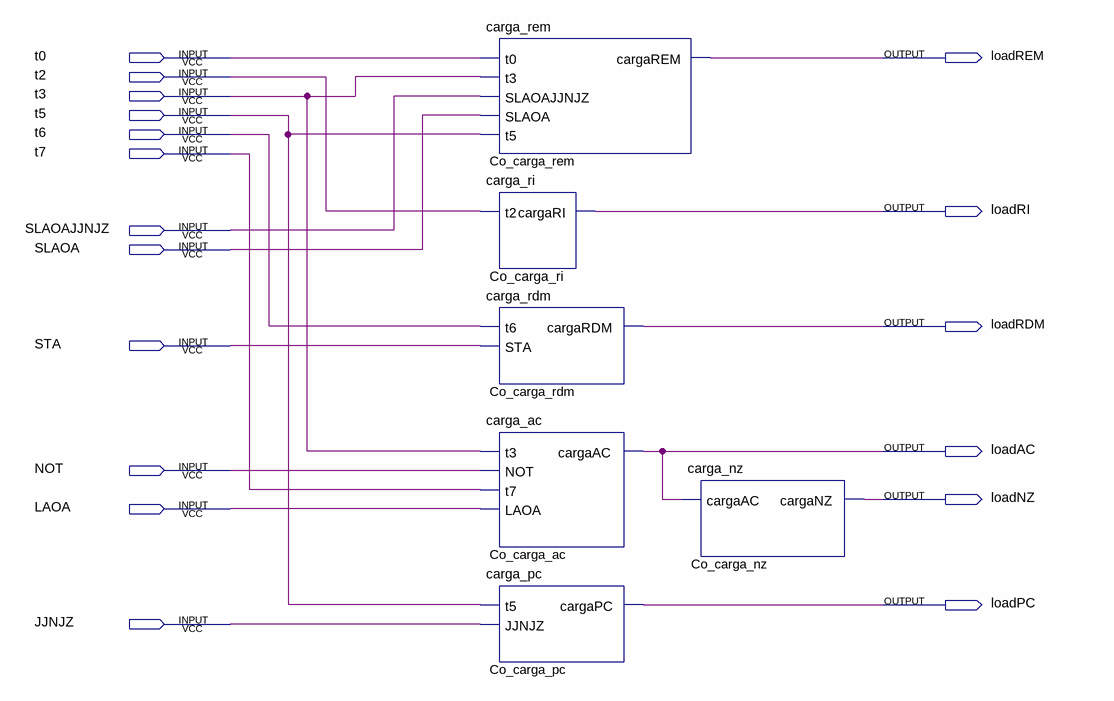
[diagram p0: schematic sheet]
// Quartus schematic uc_load.bdf as structural Verilog: 6 symbols, 18 pins
module uc_load (
  input  t0,
  input  t2,
  input  t3,
  input  t5,
  input  t6,
  input  t7,
  input  SLAOAJJNJZ,
  input  SLAOA,
  input  STA,
  input  NOT,
  input  LAOA,
  input  JJNJZ,
  output loadREM,
  output loadRI,
  output loadRDM,
  output loadAC,
  output loadNZ,
  output loadPC
);

  carga_rem Co_carga_rem (.t0(t0), .t3(t3), .SLAOAJJNJZ(SLAOAJJNJZ), .SLAOA(SLAOA), .t5(t5), .cargaREM(loadREM));
  carga_ri Co_carga_ri (.t2(t2), .cargaRI(loadRI));
  carga_rdm Co_carga_rdm (.t6(t6), .STA(STA), .cargaRDM(loadRDM));
  carga_ac Co_carga_ac (.t3(t3), .NOT(NOT), .t7(t7), .LAOA(LAOA), .cargaAC(loadAC));
  carga_pc Co_carga_pc (.t5(t5), .JJNJZ(JJNJZ), .cargaPC(loadPC));
  carga_nz Co_carga_nz (.cargaAC(loadAC), .cargaNZ(loadNZ));
endmodule
